# EAGLE design lps25h_board (EAGLE 7.2.0)
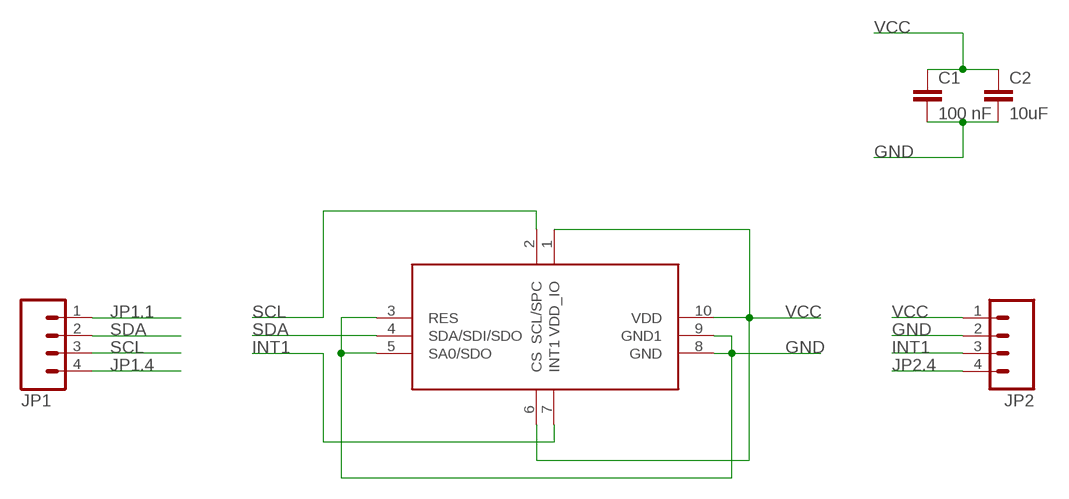
[diagram p0: schematic, sheet 1]

## Parts
C1  100 nF  CAP0805  [0805]
C2  10uF  CAP0805  [0805]
JP1  M04PTH  [1X04]
JP2  M04PTH  [1X04]
U$1  LPS25H  [LPS25H_PADS]

## Nets
GND: C1.2 C2.2 JP2.2 U$1.3(RES) U$1.5(SA0/SDO) U$1.8(GND) U$1.9(GND1)
INT1: JP2.3 U$1.7(INT1)
JP1.1: JP1.1
JP1.4: JP1.4
JP2.4: JP2.4
SCL: JP1.3 U$1.2(SCL/SPC)
SDA: JP1.2 U$1.4(SDA/SDI/SDO)
VCC: C1.1 C2.1 JP2.1 U$1.1(VDD_IO) U$1.6(CS) U$1.10(VDD)

## Library data of the parts
C1 C2 = SparkFun-Capacitors:CAP: Capacitor Standard 0603 ceramic capacitor, and 0.1" leaded capacitor.
JP1 JP2 = SparkFun-Connectors:M04: Header 4 Standard 4-pin 0.1" header. Use with straight break away headers (SKU : PRT-00116), right angle break away headers (PRT-00553), swiss pins (PRT-00743), machine pins (PRT-00117), and female headers (PRT-00115). Molex polarized connector foot print use with SKU : PRT-08231 with associated crimp pins and housings. 1MM SMD Version SKU: PRT-10208
U$1 = sensors:LPS25H

## Board
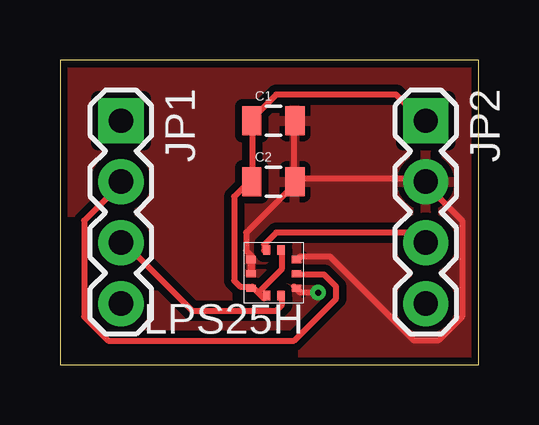
[diagram p1: board, top side]
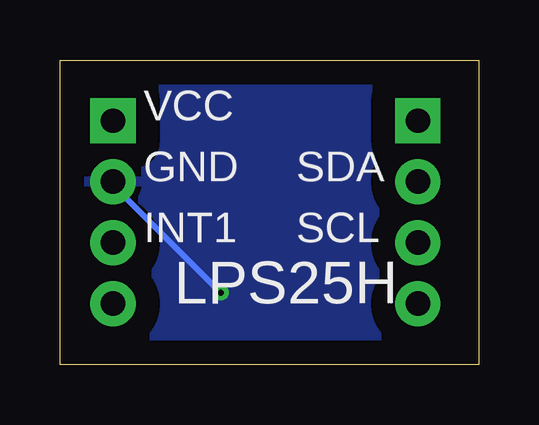
[diagram p2: board, bottom side, seen from below]

Size 17.45 x 12.69 mm. Coordinates in mm from the lower left corner, seen from the top.
Outline: 0,0 17.45,0 17.45,12.69 0,12.69 0,0
Copper layers (1*16): Top 0.035mm / dielectric 1.5mm / Bottom 0.035mm
Design rules "default *": minimum track width 0.25mm, minimum drill 0.25mm, track to track 0.25mm, track to pad 0.25mm, pad to pad 0.25mm, via to via 0.25mm, smd to smd 0.25mm, copper to edge 0.25mm, drill to drill 0.25mm, minimum pad ring 10mil, minimum via ring 8mil, stop-mask expansion 4mil, vias tented up to drill 0mil, thermal gap 10mil

### Footprints (pad centres in the part's own frame; a part is rotated, then mirrored left to right if it is on the bottom)
0805 = smd 0.8 x 1.2: 1 -0.9,0; 2 0.9,0
1X04 = drill 1.016 pad 1.88 square: 1 0,0 | drill 1.016 pad 1.88: 2 2.54,0; 3 5.08,0; 4 7.62,0
LPS25H_PADS = smd 0.3 x 0.4: 1 1.55,2.2; 2 0.95,2.2; 6 0.95,0.3; 7 1.55,0.3 | smd 0.4 x 0.3: 3 0.3,1.9; 4 0.3,1.3; 5 0.3,0.7; 8 2.2,0.7; 9 2.2,1.3; 10 2.2,1.9

### Placement (x,y rotation side)
C1  8.89,10.16 0 top
C2  8.89,7.62 0 top
JP1  2.54,10.16 270 top
JP2  15.24,10.16 270 top
U$1  10.16,5.08 180 top

### Tracks (layer width: path | path; a pad name or v marks a point on that pad's centre or on a via)
GND  (via drill 0.25)
  Top 0.25: U$1.8 8,4.5 7.75,4.75 7.75,5.5 9.75,7.5 C2.2 | C1.2 9.75,10 9.75,7.75 C2.2 | v10.75,3 10,3 9.75,3.25 U$1.3 | U$1.5 10,4.5 11.25,4.5 14.75,1 15.75,1 16.75,2 16.75,6 15.25,7.5 JP2.2 15,7.75 10,7.75 C2.2
  Top 0.305: U$1.8 U$1.9
  Bottom 0.25: v10.75,3 15.25,7.5 JP2.2
  pour Top (isolate 1): 0,12.7 0,0 17.78,0 17.78,12.7
  pour Bottom (isolate 1): 0,12.7 0,0 17.78,0 17.78,12.7
  pour Top (isolate 0.305): 0,12.7 17.78,12.7 17.78,0 0,0
INT1
  Top 0.25: U$1.7 8.5,4.75 8.5,5 9,5.5 14.75,5.5 15,5.25 JP2.3
SCL
  Top 0.25: U$1.2 9.25,2.75 9.25,2.5 9,2.25 5.5,2.25 2.75,5 JP1.3
SDA
  Top 0.25: U$1.4 10,3.75 11,3.75 11.5,3.25 11.5,2.75 9.75,1 2,1 1,2 1,6 2.5,7.5 JP1.2
VCC
  Top 0.25: 8.25,3 8.5,2.75 U$1.1 | 8.25,3 8,3.25 | 8.25,3 9.25,4 9.25,4.75 U$1.6 | 8,3.25 7.5,3.25 7.25,3.5 7.25,7 7.75,7.5 C2.1 8,7.75 8,10 C1.1 8,10.25 9,11.25 14,11.25 15,10.25 JP2.1 | 8,3.25 U$1.10

### Text on the board
bPlace: VCC | SDA | GND | SCL | INT1 | LPS25H